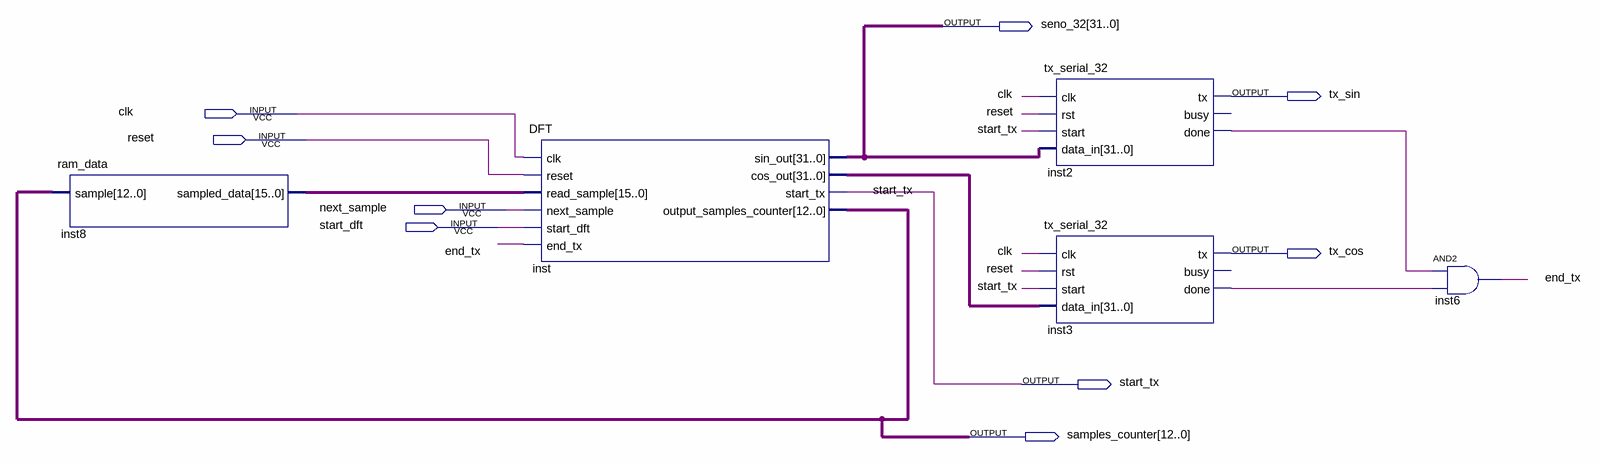
[diagram p0: schematic sheet]
// Quartus schematic execucao_produto.bdf as structural Verilog: 5 symbols, 9 pins
module execucao_produto (
  input  clk,
  input  reset,
  input  next_sample,
  input  start_dft,
  output [31:0] seno_32,
  output tx_sin,
  output tx_cos,
  output start_tx,
  output [12:0] samples_counter
);

  wire end_tx, inst2_done, inst3_done;
  wire [15:0] inst8_sampled_data;
  wire [31:0] inst_cos_out;

  ram_data inst8 (.sample(samples_counter), .sampled_data(inst8_sampled_data));
  DFT inst (
    .clk(clk), .reset(reset), .read_sample(inst8_sampled_data), .next_sample(next_sample),
    .start_dft(start_dft), .end_tx(end_tx), .sin_out(seno_32), .cos_out(inst_cos_out), .start_tx(start_tx),
    .output_samples_counter(samples_counter));
  tx_serial_32 inst2 (
    .clk(clk), .rst(reset), .start(start_tx), .data_in(seno_32), .tx(tx_sin), .done(inst2_done));  // open: busy
  tx_serial_32 inst3 (
    .clk(clk), .rst(reset), .start(start_tx), .data_in(inst_cos_out), .tx(tx_cos), .done(inst3_done));  // open: busy
  and inst6 (end_tx, inst2_done, inst3_done);
endmodule
